# EAGLE design OLM-base_v.REVG (EAGLE 6.4)
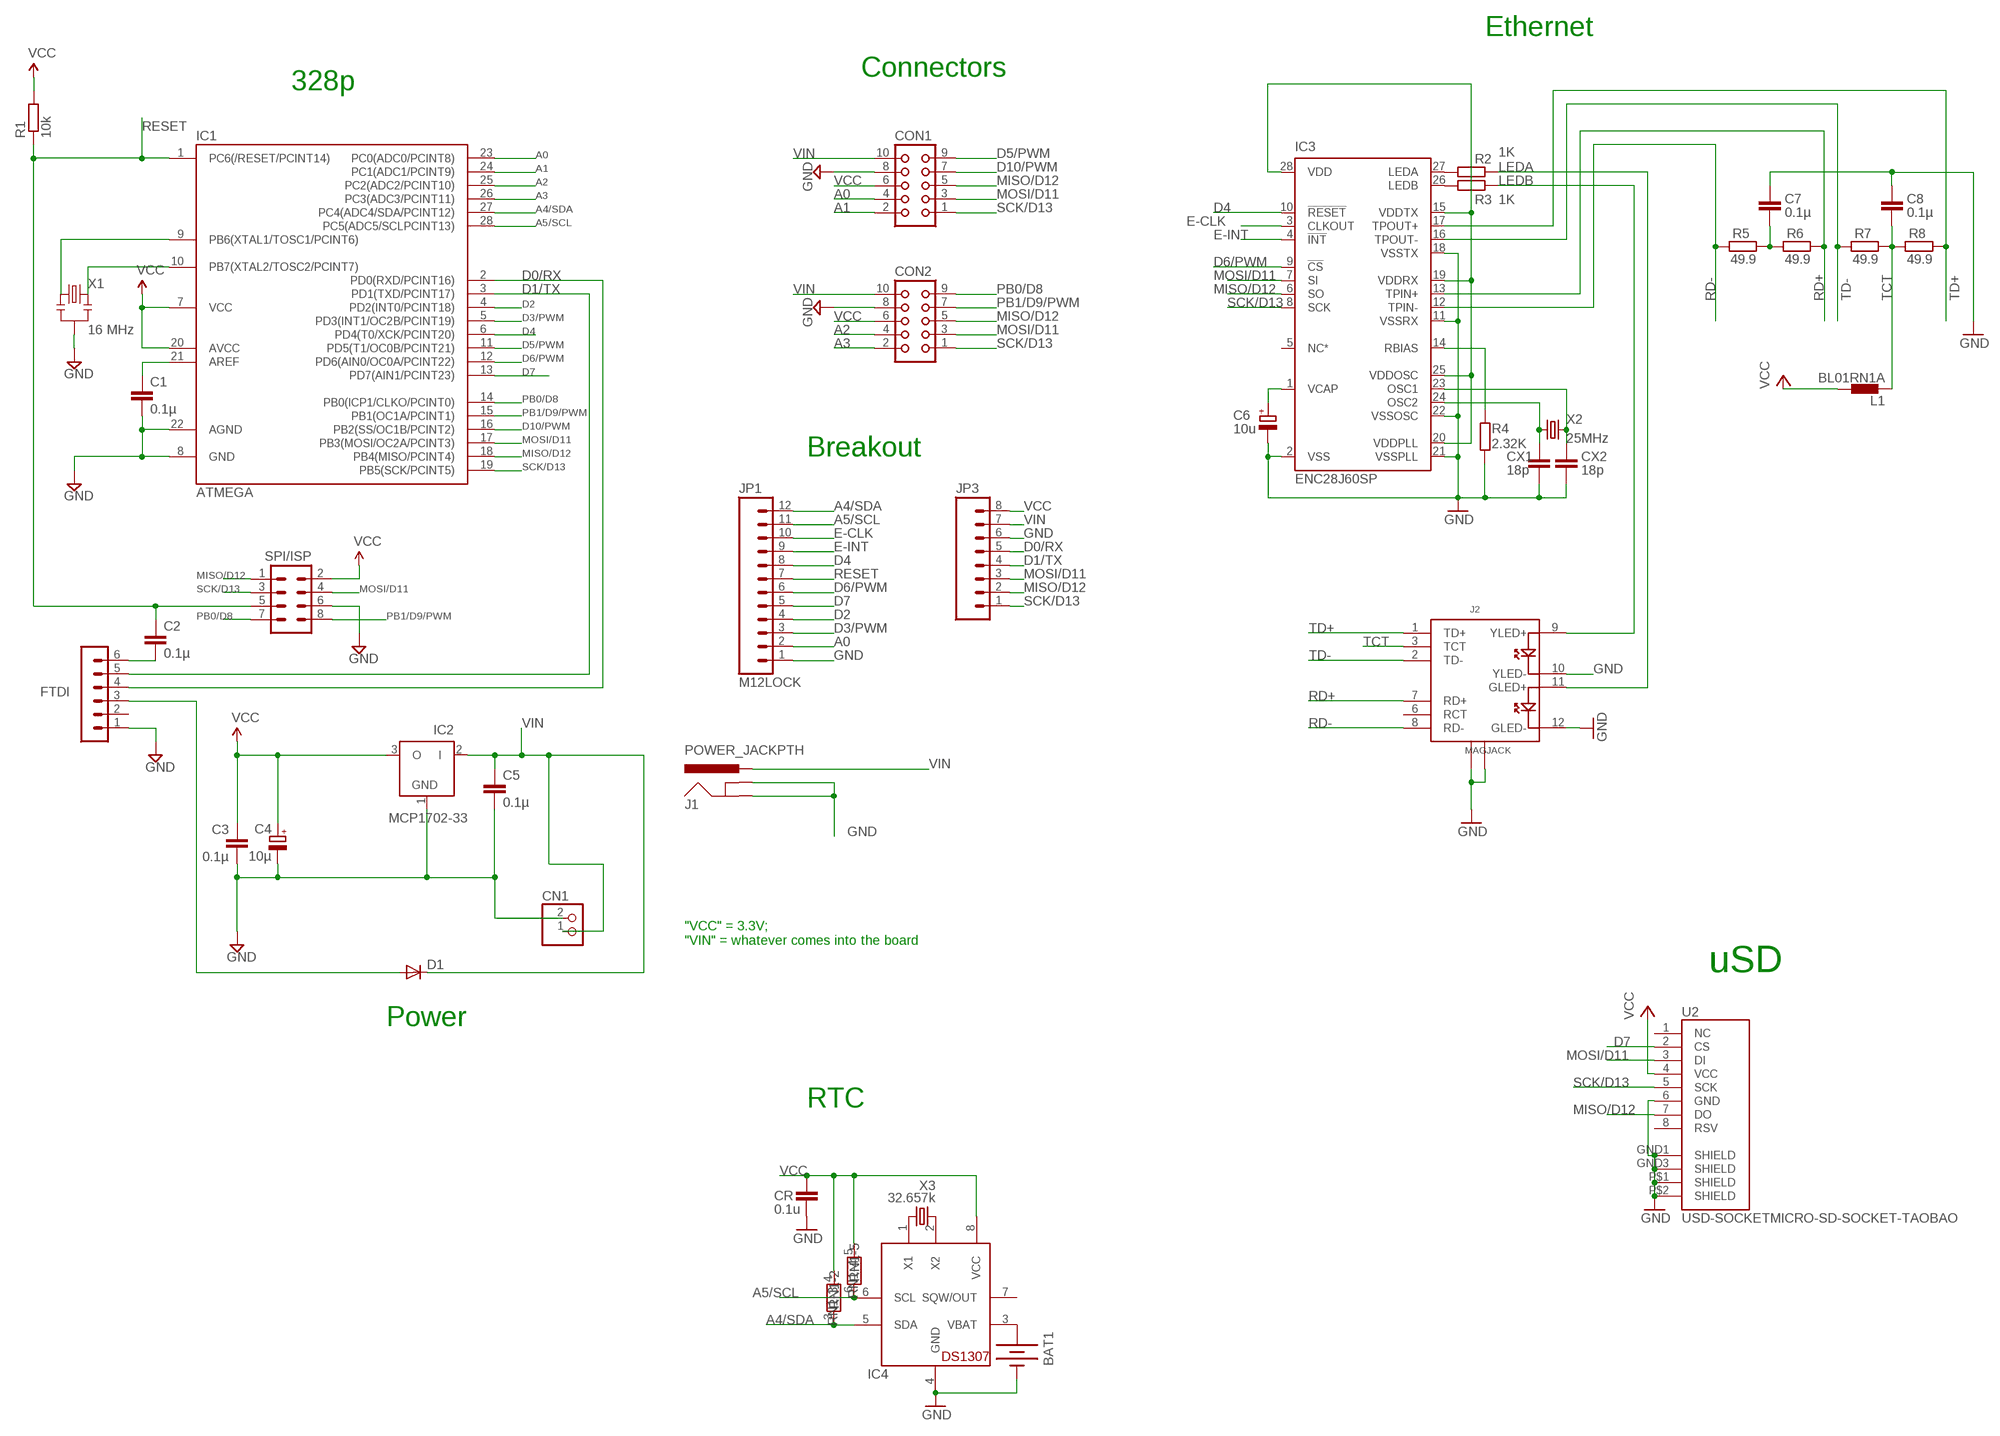
[diagram p0: schematic, sheet 1]

## Parts
BAT1  BATTERY12PTH  [BATTCON_12MM_PTH]
C1  0.1µ  C-EU025-024X044  [C025-024X044]
C2  0.1µ  C-EU025-024X044  [C025-024X044]
C3  0.1µ  C-EU025-024X044  [C025-024X044]
C4  10µ  CPOL-EUE1.8-4  [E1,8-4]
C5  0.1µ  C-EU025-024X044  [C025-024X044]
C6  10u  CPOL-EUE1.8-4  [E1,8-4]
C7  0.1µ  C-EU025-024X044  [C025-024X044]
C8  0.1µ  C-EU025-024X044  [C025-024X044]
CN1  JST_2PIN-THM-RA  [JST-PH-2-THM-RA]
CON1  CON10L  [CON10L]
CON2  CON10L  [CON10L]
CR  0.1u  C-EU025-024X044  [C025-024X044]
CX1  18p  C-EU025-024X044  [C025-024X044]
CX2  18p  C-EU025-024X044  [C025-024X044]
D1  DIODE-D-5  [D-5]
FTDI  FTDI  MA06-1  [MA06-1]
IC1  ATMEGA  ATMEGA48/88/168-PU  [DIL28-3]
IC2  MCP1702-33  MCP1702Z  [TO92]
IC3  ENC28J60SP  [DIL28-3]
IC4  DS1307  [DIL08]
J1  POWER_JACKPTH  [POWER_JACK_PTH]
J2  MAGJACK  [MAGJACK]
JP1  M12LOCK  [1X12_LOCK]
JP3  M08LOCK  [1X08_LOCK]
L1  BL01RN1A  [BL01RN1A]
R1  10k  R-EU_0204/7  [0204/7]
R2  1K  R-EU_0204/7  [0204/7]
R3  1K  R-EU_0204/7  [0204/7]
R4  2.32K  R-EU_0204/7  [0204/7]
R5  49.9  R-EU_0204/7  [0204/7]
R6  49.9  R-EU_0204/7  [0204/7]
R7  49.9  R-EU_0204/7  [0204/7]
R8  49.9  R-EU_0204/7  [0204/7]
RN1  RNX7  [RN-8]
SV1  SPI/ISP  MA04-2  [MA04-2]
U2  USD-SOCKETMICRO-SD-SOCKET-TAOBAO  [MICRO-SD-SOCKET-TAOBAO]
X1  16 MHz  RESONATORPTH  [RESONATOR-PTH]
X2  25MHz  CRYSTALHC49US  [HC49US]
X3  32.657k  CRYSTALTC26H  [TC26H]

## Nets
A0: CON1.4 IC1.23(PC0(ADC0/PCINT8)) JP1.2
A1: CON1.2 IC1.24(PC1(ADC1/PCINT9))
A2: CON2.4 IC1.25(PC2(ADC2/PCINT10))
A3: CON2.2 IC1.26(PC3(ADC3/PCINT11))
A4/SDA: IC1.27(PC4(ADC4/SDA/PCINT12)) IC4.5(SDA) JP1.12 RN1.3
A5/SCL: IC1.28(PC5(ADC5/SCLPCINT13)) IC4.6(SCL) JP1.11 RN1.6
D0/RX: FTDI.4 IC1.2(PD0(RXD/PCINT16)) JP3.5
D1/TX: FTDI.5 IC1.3(PD1(TXD/PCINT17)) JP3.4
D2: IC1.4(PD2(INT0/PCINT18)) JP1.4
D3/PWM: IC1.5(PD3(INT1/OC2B/PCINT19)) JP1.3
D4: IC1.6(PD4(T0/XCK/PCINT20)) IC3.10(!RESET) JP1.8
D5/PWM: CON1.9 IC1.11(PD5(T1/OC0B/PCINT21))
D6/PWM: IC1.12(PD6(AIN0/OC0A/PCINT22)) IC3.9(!CS) JP1.6
D7: IC1.13(PD7(AIN1/PCINT23)) JP1.5 U2.2(CS)
D10/PWM: CON1.7 IC1.16(PB2(SS/OC1B/PCINT2))
E-CLK: IC3.3(CLKOUT) JP1.10
E-INT: IC3.4(!INT) JP1.9
GND [vcc]: BAT1.GND(-) C1.2 C3.2 C4.- C5.2 C6.- C7.1 C8.1 CN1.2 CON1.8 CON2.8 CR.2 CX1.2 CX2.2 FTDI.1 IC1.8(GND) IC1.22(AGND) IC2.1(GND) IC3.2(VSS) IC3.11(VSSRX) IC3.18(VSSTX) IC3.21(VSSPLL) IC3.22(VSSOSC) IC4.4(GND) J1.GND J1.GNDBREAK J2.10(YLED-) J2.12(GLED-) J2.M1(GND1) J2.M2(GND2) JP1.1 JP3.6 R4.2 SV1.6 U2.6(GND) U2.GND1(SHIELD) U2.GND3(SHIELD) U2.P$1(SHIELD) U2.P$2(SHIELD) X1.2
LEDA: J2.11(GLED+) R2.2
LEDB: J2.9(YLED+) R3.2
MISO/D12: CON1.5 CON2.5 IC1.18(PB4(MISO/PCINT4)) IC3.6(SO) JP3.2 SV1.1 U2.7(DO)
MOSI/D11: CON1.3 CON2.3 IC1.17(PB3(MOSI/OC2A/PCINT3)) IC3.7(SI) JP3.3 SV1.4 U2.3(DI)
N$1: IC1.9(PB6(XTAL1/TOSC1/PCINT6)) X1.1
N$2: D1.A FTDI.3
N$19: C1.1 IC1.21(AREF)
N$20: C2.2 FTDI.6
N$21: IC1.10(PB7(XTAL2/TOSC2/PCINT7)) X1.3
N$36: BAT1.VCC@1(+) IC4.3(VBAT)
N$37: IC3.27(LEDA) R2.1
N$39: IC3.26(LEDB) R3.1
N$47: IC4.2(X2) X3.2
N$50: C6.+ IC3.1(VCAP)
N$51: IC3.14(RBIAS) R4.1
N$52: CX1.1 IC3.24(OSC2) X2.1
N$53: CX2.1 IC3.23(OSC1) X2.2
N$54: C7.2 R5.2 R6.1
N$57: IC4.1(X1) X3.1
PB0/D8: CON2.9 IC1.14(PB0(ICP1/CLKO/PCINT0)) SV1.7
PB1/D9/PWM: CON2.7 IC1.15(PB1(OC1A/PCINT1)) SV1.8
RD+: IC3.13(TPIN+) J2.7(RD+) R6.2
RD-: IC3.12(TPIN-) J2.8(RD-) R5.1
RESET: C2.1 IC1.1(PC6(/RESET/PCINT14)) JP1.7 R1.1 SV1.5
SCK/D13: CON1.1 CON2.1 IC1.19(PB5(SCK/PCINT5)) IC3.8(SCK) JP3.1 SV1.3 U2.5(SCK)
TCT: C8.2 J2.3(TCT) L1.1 R7.2 R8.1
TD+: IC3.17(TPOUT+) J2.1(TD+) R8.2
TD-: IC3.16(TPOUT-) J2.2(TD-) R7.1
VCC [vcc]: C3.1 C4.+ CON1.6 CON2.6 CR.1 IC1.7(VCC) IC1.20(AVCC) IC2.3(O) IC3.15(VDDTX) IC3.19(VDDRX) IC3.20(VDDPLL) IC3.25(VDDOSC) IC3.28(VDD) IC4.8(VCC) JP3.8 L1.2 R1.2 RN1.4 RN1.5 SV1.2 U2.4(VCC)
VIN: C5.1 CN1.1 CON1.10 CON2.10 D1.C IC2.2(I) J1.PWR JP3.7
Unconnected: FTDI.2 IC3.5(NC*) IC4.7(SQW/OUT) J2.6(RCT) RN1.1 RN1.2 RN1.7 RN1.8 U2.1(NC) U2.8(RSV)

## Notes on the sheet
- Ethernet
- Connectors
- 328p
- Breakout
- "VCC" = 3.3V;
  "VIN" = whatever comes into the board
- uSD
- Power
- RTC

## Library data of the parts
BAT1 = SparkFun:BATTERY: Battery Holders Various common sizes : AA, AAA, 20mm coin cell and 12mm coin cell.
C1-C3 C5 C7 C8 CX1 CX2 = resistor:C-EU: CAPACITOR, European symbol
C4 C6 = resistor:CPOL-EU: POLARIZED CAPACITOR, European symbol
CN1 = adafruit:JST_2PIN: JST 2-Pin Connectors of various flavors SMT-RA (S2B-PH-SM4) 4UConnector #17311 SMT (B2B-PH-SM4) THM-RA (S2B-PH) THM (B2B-PH)
CON1 CON2 = con-harting:CON10L: CONNECTOR; OC_FARNELL: unknown; OC_NEWARK: unknown
CR = rcl:C-EU: CAPACITOR, European symbol
D1 = diode:DIODE-: DIODE
FTDI = JeeLabs:MA06-1: PIN HEADER
IC1 = atmega8:ATMEGA48/88/168-PU
IC2 = JeeLabs:MCP1702: 200 mA, Low Power Low Dropout Voltage Regulator
IC3 = microchip:ENC28J60: Stand-Alone Ethernet Controller with SPI Interface Source: http://ww1.microchip.com/downloads/en/DeviceDoc/39662c.pdf; MF: MICROCHIP; MPN: ENC28J60/SP; OC_FARNELL: 1084619; OC_NEWARK: 96K3661
IC4 = adafruit:DS1307: DS1307 Real time clock (RTC) with battery backup ability. Talk to it via i2c
J1 = SparkFun-Connectors:POWER_JACK: Power Jack This is the standard 5.5mm barrel jack for power. The PTH is the most common, proven, reliable, footprint. The Slot footprint only works if the mill layer is transmitted to the PCB fab house so be warned. Spark Fun Electronics SKU : PRT-00119 SMT: CONN-08106 Mating wall wart : TOL-00298 (and others)
J2 = SparkFun:MAGJACK
JP1 = SparkFun-Connectors:M12: Header 12 Standard 12-pin 0.1" header. Use with straight break away headers (SKU : PRT-00116), right angle break away headers (PRT-00553), swiss pins (PRT-00743), machine pins (PRT-00117), and female headers (PRT-00115).
JP3 = SparkFun-Connectors:M08: Header 8 Standard 8-pin 0.1" header. Use with straight break away headers (SKU : PRT-00116), right angle break away headers (PRT-00553), swiss pins (PRT-00743), machine pins (PRT-00117), and female headers (PRT-00115).
L1 = inductors:BL0: Noise Suppression Products/EMI Suppression Filters, Lead EMIFIL(R) Inductor Type Source: http://www.murata.com .. BL01RN1_DS.pdf
R1 = resistor:R-EU_: RESISTOR, European symbol
R2-R8 = rcl:R-EU_: RESISTOR, European symbol
RN1 = resistor-net:RNX7: RESISTOR NETWORK; OC_FARNELL: unknown; OC_NEWARK: unknown
SV1 = JeeLabs:MA04-2: PIN HEADER
U2 = SparkFunNew:USD-SOCKET: microSD Socket Push-push type uSD socket. Schematic element and footprint production proven. Spark Fun Electronics SKU : PRT-00127. tDoc lines correctly indicate media card edge positions when inserting (unlocked, locked, depressed).
X1 = SparkFun:RESONATOR: Resonator Small SMD resonator. This is the itty bitty 10/20MHz resonators with built in caps. CSTCE10M0G55 and CSTCE20M0V53. Footprint has been reviewed closely but hasn't been tested yet.
X2 = SparkFun:CRYSTAL: Crystals Various standard crystals. Proven footprints. Spark Fun Electronics SKU : COM-00534
X3 = crystal:CRYSTAL: CRYSTAL; OC_FARNELL: unknown; OC_NEWARK: unknown

## Net classes
0 default: width 0.305 mm, clearance 0.203 mm
1 vcc: width 0.254 mm
2 gnd: width 0.305 mm, drill 0.559 mm, clearance 0.254 mm

## Board
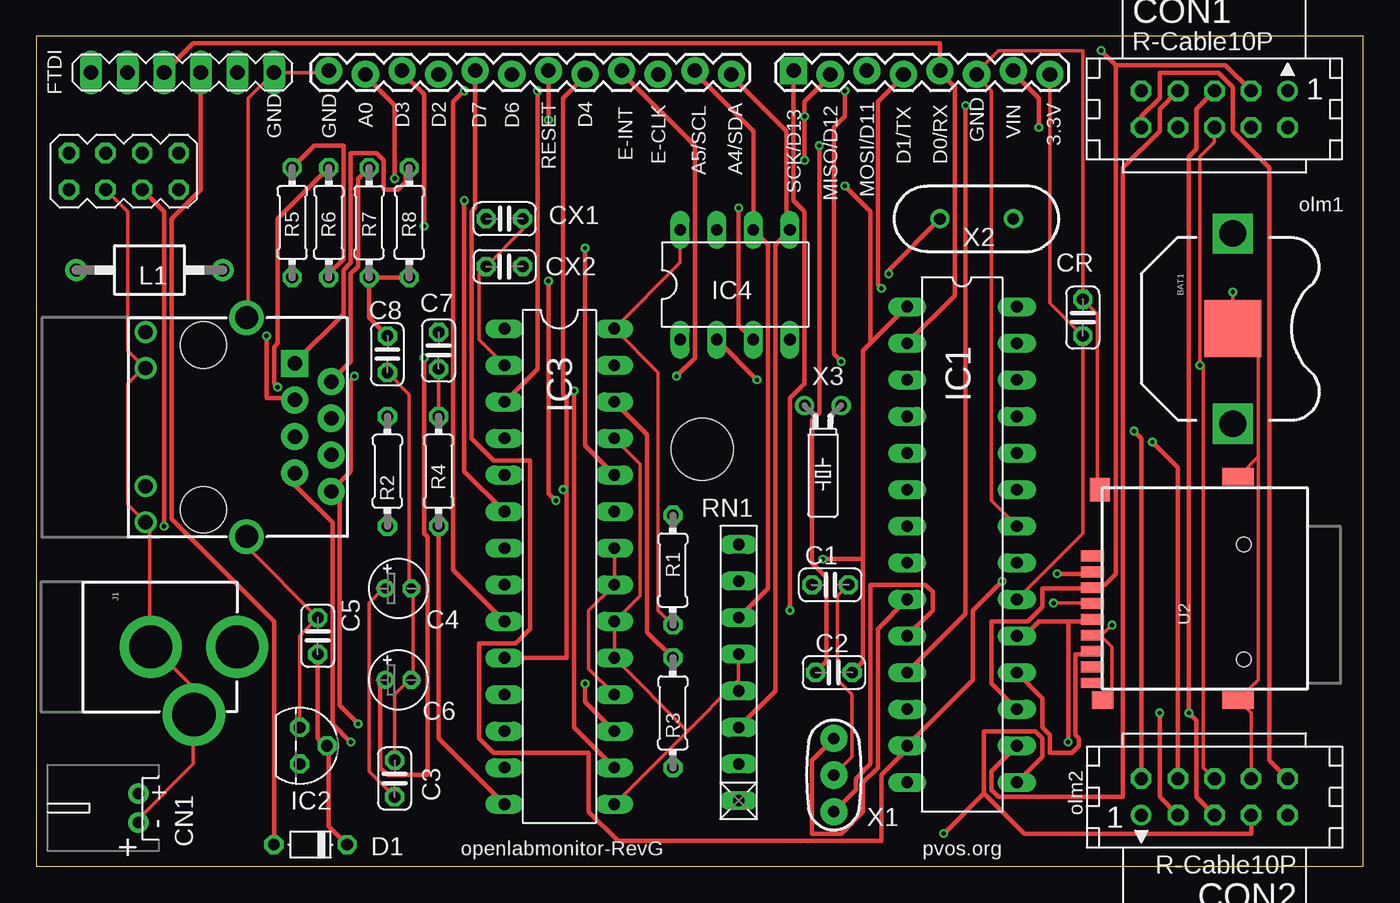
[diagram p1: board, top side]
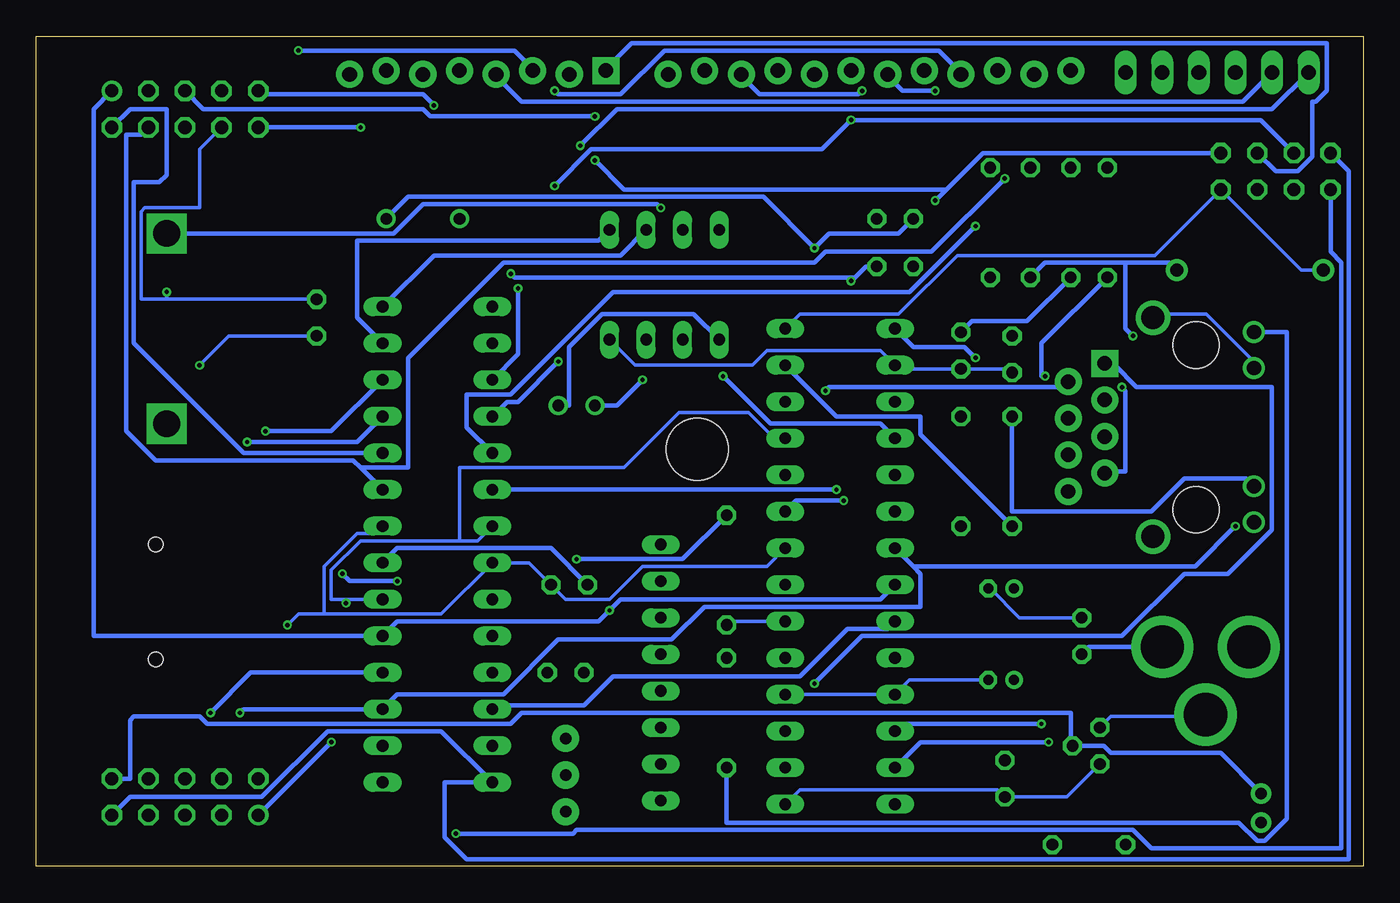
[diagram p2: board, bottom side, seen from below]

Size 92.13 x 57.65 mm. Coordinates in mm from the lower left corner, seen from the top.
Outline: 0,0 92.13,0 92.13,57.65 0,57.65 0,0
Copper layers (1*16): Top 0.035mm / dielectric 1.5mm / Bottom 0.035mm
Design rules "Fusion_eagle_rule_v1.1": minimum track width 6mil, minimum drill 12mil, track to track 6mil, track to pad 6mil, pad to pad 6mil, via to via 6mil, smd to smd 0mil, copper to edge 10mil, drill to drill 10mil, minimum pad ring 10mil, minimum via ring 6mil, stop-mask expansion 2mil, vias tented up to drill 100mil, thermal gap 10mil
Holes 4.32 mm at 46.23,28.96

### Footprints (pad centres in the part's own frame; a part is rotated, then mirrored left to right if it is on the bottom)
BATTCON_12MM_PTH = smd 3.962 x 3.962: GND 0,0 | drill 1.854 square: VCC@1 -6.604,0; VCC@2 6.604,0
C025-024X044 = drill 0.813 octagon: 1 -1.27,0; 2 1.27,0
E1,8-4 = drill 0.711 pad 1.168: + -0.889,0 | drill 0.711 pad 1.168 octagon: - 0.889,0
JST-PH-2-THM-RA = drill 0.8 pad 1.422: 1 1,0; 2 -1,0
CON10L = drill 0.914: 1 5.08,1.27 | drill 0.914 octagon: 2 5.08,-1.27; 3 2.54,1.27; 4 2.54,-1.27; 5 0,1.27; 6 0,-1.27; 7 -2.54,1.27; 8 -2.54,-1.27; 9 -5.08,1.27; 10 -5.08,-1.27
D-5 = drill 0.813 octagon: A 2.54,0; C -2.54,0
MA06-1 = drill 1.016 long: 1 0,0; 2 2.54,0; 3 5.08,0; 4 7.62,0; 5 10.16,0; 6 12.7,0
DIL28-3 = drill 0.813 long: 1 -16.51,-3.81; 2 -13.97,-3.81; 3 -11.43,-3.81; 4 -8.89,-3.81; 5 -6.35,-3.81; 6 -3.81,-3.81; 7 -1.27,-3.81; 8 1.27,-3.81; 9 3.81,-3.81; 10 6.35,-3.81; 11 8.89,-3.81; 12 11.43,-3.81; 13 13.97,-3.81; 14 16.51,-3.81; 15 16.51,3.81; 16 13.97,3.81; 17 11.43,3.81; 18 8.89,3.81; 19 6.35,3.81; 20 3.81,3.81; 21 1.27,3.81; 22 -1.27,3.81; 23 -3.81,3.81; 24 -6.35,3.81; 25 -8.89,3.81; 26 -11.43,3.81; 27 -13.97,3.81; 28 -16.51,3.81
TO92 = drill 0.813 octagon: 1 -1.27,0; 2 0,1.905; 3 1.27,0
DIL08 = drill 0.813 long: 1 -3.81,-3.81; 2 -1.27,-3.81; 3 1.27,-3.81; 4 3.81,-3.81; 5 3.81,3.81; 6 1.27,3.81; 7 -1.27,3.81; 8 -3.81,3.81
POWER_JACK_PTH = drill 2.997 pad 4.318: GND 0,7.7; GNDBREAK 4.7,10.7; PWR 0,13.7
MAGJACK = drill 1 pad 1.88 square: 1 3.175,17.445 | drill 1 pad 1.88: 2 4.445,19.985; 3 5.715,17.445; 4 6.985,19.985; 5 8.255,17.445; 6 9.525,19.985; 7 10.795,17.445; 8 12.065,19.985 | drill 1 pad 1.27: 9 1,7.1; 10 3.5,7.1; 11 11.7,7.1; 12 14.2,7.1 | drill 1.6 pad 2.184: M1 0,14.1; M2 15.2,14.1 | hole 3.2: 1.905,11.095; 13.335,11.095
1X12_LOCK = drill 1.016 pad 1.88: 1 0,0.127; 2 2.54,-0.127; 3 5.08,0.127; 4 7.62,-0.127; 5 10.16,0.127; 6 12.7,-0.127; 7 15.24,0.127; 8 17.78,-0.127; 9 20.32,0.127; 10 22.86,-0.127; 11 25.4,0.127; 12 27.94,-0.127
1X08_LOCK = drill 1.016 pad 1.88 square: 1 0,0.127 | drill 1.016 pad 1.88: 2 2.54,-0.127; 3 5.08,0.127; 4 7.62,-0.127; 5 10.16,0.127; 6 12.7,-0.127; 7 15.24,0.127; 8 17.78,-0.127
BL01RN1A = drill 0.9 pad 1.5: 1 -5.08,0; 2 5.08,0
0204/7 = drill 0.813 octagon: 1 -3.81,0; 2 3.81,0
RN-8 = drill 0.813 long: 1 -8.89,0; 2 -6.35,0; 3 -3.81,0; 4 -1.27,0; 5 1.27,0; 6 3.81,0; 7 6.35,0; 8 8.89,0
MA04-2 = drill 0.9 octagon: 1 -3.81,-1.27; 2 -3.81,1.27; 3 -1.27,-1.27; 4 -1.27,1.27; 5 1.27,-1.27; 6 1.27,1.27; 7 3.81,-1.27; 8 3.81,1.27
MICRO-SD-SOCKET-TAOBAO = smd 0.75 x 1.6: 1 2.25,10.5; 2 1.15,10.5; 3 0.05,10.5; 4 -1.05,10.5; 5 -2.15,10.5; 6 -3.25,10.5; 7 -4.35,10.5; 8 -5.45,10.5 | smd 0.7 x 1.6: CD -6.55,10.5 | smd 1.2 x 1.5: GND1 -7.75,9.8 | smd 1.6 x 1.4: GND3 6.85,10 | smd 1.2 x 2.2: P$1 7.75,0.4; P$2 -7.75,0.4 | hole 1: 3.05,0; -4.93,0
RESONATOR-PTH = drill 0.8 pad 1.88: 1 -2.54,0; 2 0,0; 3 2.54,0
HC49US = drill 0.813: 1 -2.54,0; 2 2.54,0
TC26H = drill 0.813: 1 -1.27,0; 2 1.27,0

### Placement (x,y rotation side)
BAT1  83.06,37.34 270 top
C1  55.12,19.56 0 top
C2  55.37,13.46 180 top
C3  24.89,6.1 90 top
C4  25.15,19.3 0 top
C5  19.56,16 90 top
C6  25.15,12.95 0 top
C7  27.94,35.81 90 top
C8  24.38,35.56 90 top
CN1  7.11,4.06 90 top
CON1  81.79,52.58 0 top
CON2  81.79,4.83 180 top
CR  72.64,38.1 90 top
CX1  32.51,44.96 0 top
CX2  32.51,41.66 180 top
D1  19.05,1.52 180 top
FTDI  16.51,55.12 180 top
IC1  64.26,22.35 270 top
IC2  18.29,8.38 270 top
IC3  36.32,20.83 270 top
IC4  48.51,40.39 0 top
J1  0.25,15.24 270 top
J2  0.51,38.1 270 top
JP1  20.32,55.12 0 top
JP3  52.58,55.12 0 top
L1  7.87,41.4 180 top
R1  44.2,20.57 270 top
R2  24.38,27.43 90 top
R3  44.2,10.67 270 top
R4  27.94,27.43 90 top
R5  17.78,44.7 90 top
R6  20.32,44.7 90 top
R7  23.11,44.7 270 top
R8  25.91,44.7 90 top
RN1  48.77,13.46 90 top
SV1  6.1,48.26 180 top
U2  83.82,19.3 90 top
X1  55.37,6.35 270 top
X2  65.28,44.96 180 top
X3  54.61,32 180 top

### Tracks (layer width: path | path; a pad name or v marks a point on that pad's centre or on a via)
A0  (via drill 0.3)
  Top 0.305: v24.89,47.75 24.89,52.83 22.86,54.86 JP1.2
  Bottom 0.305: 69.6,27.69 70.1,28.19 83.82,28.19 85.85,30.23 85.85,50.8 84.84,50.8 CON1.4 | 69.6,27.69 IC1.23 | v24.89,47.75 29.97,42.67 37.34,42.67 38.1,41.91 59.69,41.91 66.29,35.31 66.29,27.69 69.6,27.69
A1
  Bottom 0.305: IC1.24 77.72,28.7 85.34,36.32 85.34,47.5 83.57,47.5 83.06,48.01 83.06,52.58 85.6,52.58 CON1.2
A2  (via drill 0.3)
  Top 0.305: v77.47,29.46 79.25,27.69 CON2.4
  Bottom 0.305: IC1.25 69.85,29.46 v77.47,29.46
A3  (via drill 0.3)
  Top 0.305: v76.2,30.23 76.71,29.72 CON2.2
  Bottom 0.305: IC1.26 71.63,30.23 v76.2,30.23
A4/SDA
  Top 0.305: RN1.3 51.31,12.19 51.31,43.18 52.07,43.94 | 52.07,43.94 52.07,51.05 48.26,54.86 JP1.12 | 52.07,43.94 IC4.5
  Bottom 0.305: IC1.27 69.85,38.1 69.85,43.43 53.09,43.43 IC4.5
A5/SCL
  Top 0.305: RN1.6 50.8,19.3 50.8,43.18 IC4.6 49.78,51.05 45.72,55.12 JP1.11
  Bottom 0.305: IC1.28 64.52,42.42 51.56,42.42 IC4.6
D0/RX
  Top 0.305: IC1.2 63.75,39.62 63.75,54.1 62.74,55.12 JP3.5 62.74,57.15 10.92,57.15 FTDI.4
D1/TX  (via drill 0.3)
  Top 0.305: v58.67,40.13 58.42,40.39 58.42,53.09 60.2,54.86 JP3.4
  Bottom 0.305: IC1.3 58.67,35.56 v58.67,40.13 | FTDI.5 8.38,53.09 58.42,53.09 60.2,54.86 JP3.4
D2  (via drill 0.3)
  Top 0.305: v55.88,35.05 55.37,35.56 55.37,51.31 56.13,52.07 v56.13,53.85
  Bottom 0.305: IC1.4 59.44,32.26 58.67,32.26 v55.88,35.05 | v56.13,53.85 55.88,53.59 51.56,53.59 48.51,56.64 29.46,56.64 27.94,55.12 JP1.4
D3/PWM  (via drill 0.3)
  Top 0.305: v26.92,44.45 26.92,53.59 25.4,55.12 JP1.3
  Bottom 0.305: IC1.5 62.23,30.48 62.23,32.77 59.18,32.77 52.07,39.88 31.5,39.88 v26.92,44.45
D4  (via drill 0.3)
  Top 0.305: IC3.10 36.83,14.48 36.83,26.16 | 36.83,26.16 36.83,32.51 36.58,32.77 36.58,53.34 38.1,54.86 JP1.8 | 36.83,26.16 v36.58,26.16
  Bottom 0.305: v36.58,26.16 IC1.6
D5/PWM  (via drill 0.3)
  Top 0.305: IC1.11 64.52,17.53 v64.52,52.83
  Bottom 0.305: v64.52,52.83 65.28,53.59 76.45,53.59 CON1.9
D6/PWM  (via drill 0.3)
  Top 0.305: v29.72,53.85 28.96,53.09 28.96,20.57 IC3.9
  Bottom 0.305: IC3.9 33.02,16.51 35.81,16.51 39.12,13.21 52.07,13.21 54.1,11.18 60.2,11.18 IC1.12 | v29.72,53.85 32,53.85 33.02,54.86 JP1.6
D7  (via drill 0.3)
  Top 0.305: v70.87,20.32 73.15,20.32 U2.2 | v67.06,19.81 65.02,17.78 65.02,12.95 IC1.13 60.45,8.13 58.67,6.35 58.67,1.78 40.39,1.78 38.35,3.81 38.35,7.87 31.75,7.87 30.73,8.89 30.73,15.49 33.27,15.49 34.29,16.51 34.29,28.19 31.75,28.19 30.23,29.72 30.23,45.47 30.48,45.72 JP1.5
  Bottom 0.305: v70.87,20.32 70.36,19.81 v67.06,19.81
D10/PWM
  Top 0.305: IC1.16 66.29,6.6 66.29,5.33 66.8,4.83 75.44,4.83 75.44,48.51 77.98,51.05 77.98,52.58 CON1.7
E-CLK  (via drill 0.3)
  Top 0.305: IC3.3 34.8,34.54 v34.8,53.85
  Bottom 0.305: v34.8,53.85 35.05,53.59 41.91,53.59 43.18,54.86 JP1.10
E-INT  (via drill 0.3)
  Top 0.305: v44.45,34.04 45.72,35.31 45.72,50.04 40.64,55.12 JP1.9
  Bottom 0.305: IC3.4 33.53,30.73 41.15,30.73 v44.45,34.04
GND  (via drill 0.3)
  Top 0.254: CON2.8 84.33,10.67 83.57,11.43 U2.P$2 83.57,11.68 84.84,12.95 84.84,28.45 | 84.84,28.45 83.57,27.18 U2.P$1 | 84.84,28.45 84.84,35.56 BAT1.GND v83.06,39.88 | U2.GND3 73.66,26.16 73.66,38.35 CR.2 72.64,56.64 66.8,56.64 65.28,55.12 JP3.6 65.28,54.86 66.29,53.85 66.29,25.4 IC1.22 | CX1.2 33.78,44.2 CX2.2 30.73,41.15 30.73,36.58 IC3.2 | C7.1 R4.2 | JP1.1 20.32,55.12 FTDI.1 14.73,53.34 14.73,38.1 J2.M1 | SV1.6 6.35,45.47 6.35,35.81 7.37,34.8 J2.10 7.37,34.54 6.35,33.53 6.35,25.15 7.37,24.13 J2.12 7.62,23.88 7.87,23.62 7.87,15.24 J1.GND 8.13,15.24 10.92,12.45 10.92,10.67 J1.GNDBREAK 10.92,10.41 10.92,7.11 7.11,3.3 CN1.2 | 73.91,16 74.68,15.24 74.68,12.19 74.17,11.68 U2.GND1 | 73.91,16 73.41,16 U2.6 73.91,16 | v74.68,16.76 73.91,16 | X1.2 56.64,7.62 56.64,11.94 55.63,12.95 55.63,18.8 C1.2 | IC3.22 IC3.21 38.35,17.78 38.35,13.72 IC3.18 | C3.2 24.89,11.94 25.91,12.95 C6.- 26.16,12.95 26.16,19.3 C4.- 25.91,19.3 25.91,32.77 C8.1 | J2.M2 14.73,22.86 14.73,22.1 C5.2 18.29,16 IC2.1
  Bottom 0.254: CON1.8 80.77,49.78 80.77,45.72 84.58,45.72 84.84,45.47 84.84,39.37 83.06,39.37 | CR.2 83.06,39.37 | 83.06,39.37 v83.06,39.88 | C8.1 24.64,34.54 C7.1 32.26,34.54 IC3.2 33.53,35.81 41.4,35.81 42.42,34.8 50.55,34.8 IC4.4 | J2.M1 14.48,38.1 14.22,38.35 10.92,38.35 7.37,34.8 J2.10 | IC1.22 68.58,23.11 69.85,23.11 72.14,20.83 72.14,17.53 | 72.14,17.53 64.01,17.53 IC1.8 57.91,21.08 C1.2 55.37,18.54 52.32,18.54 50.04,20.83 41.4,20.83 IC3.22 | v74.68,16.76 73.91,17.53 72.14,17.53 | C6.- 31.5,12.95 IC3.11 IC3.18 | IC2.1 17.53,10.41 11.18,10.41 J1.GNDBREAK | C5.2 23.88,17.27 25.91,19.3 C4.-
LEDA
  Bottom 0.305: R2.2 24.38,24.64 14.73,24.64 12.45,26.92 8.13,26.92 7.62,26.42 J2.11
LEDB
  Bottom 0.305: R3.2 44.2,3.05 8.64,3.05 7.37,1.78 6.86,1.78 5.33,3.3 5.33,37.08 7.37,37.08 J2.9
MISO/D12  (via drill 0.3)
  Top 0.305: IC1.18 69.85,11.68 69.85,9.65 70.36,9.14 70.36,7.87 71.88,7.87 72.39,8.38 72.39,8.89 72.14,9.14 72.14,14.73 73.15,14.73 U2.7 | CON2.5 80.52,4.83 80.52,10.16 v80.01,10.67 80.01,49.28 80.52,49.78 80.52,52.58 CON1.5 | IC3.6 29.72,27.43 v29.72,46.23 | v53.34,49.02 v53.34,52.07 53.34,53.09 55.12,54.86 JP3.2
  Bottom 0.305: v80.01,10.67 77.22,13.46 IC1.18 | 28.96,46.99 26.42,49.53 SV1.1 | 28.96,46.99 v29.72,46.23 | v53.34,49.02 51.31,46.99 28.96,46.99 | CON1.5 80.52,52.58 65.28,52.58 64.77,52.07 v53.34,52.07
MOSI/D11  (via drill 0.3)
  Top 0.305: IC1.17 66.29,12.7 66.29,17.02 68.83,17.02 69.85,18.03 69.85,19.3 73.15,19.3 U2.3 73.41,19.56 74.17,19.56 74.93,20.32 74.93,55.63 | SV1.4 8.89,45.47 v8.89,23.62 | CON2.3 77.98,4.83 v77.98,10.67 | CON1.3 82.55,55.63 74.93,55.63 | 74.93,55.63 v73.91,56.64
  Bottom 0.305: 31.24,20.83 30.73,20.32 30.73,18.03 45.72,18.03 48.01,15.75 55.88,15.75 59.69,11.94 67.06,11.94 IC1.17 77.72,10.92 v77.98,10.67 | 31.24,20.83 IC3.7 | v8.89,23.62 11.68,20.83 31.24,20.83 | v73.91,56.64 58.93,56.64 57.66,55.37 JP3.3
N$1
  Top 0.305: IC1.9 58.42,16.51 58.42,6.86 57.4,5.84 57.4,3.81 55.88,2.29 53.85,2.29 53.85,7.37 X1.1
N$2
  Top 0.305: D1.A 16.51,17.02 9.4,24.13 9.4,44.96 11.43,46.99 FTDI.3
N$19
  Bottom 0.305: C1.1 56.39,22.1 67.06,22.1 IC1.21
N$20  (via drill 0.3)
  Top 0.305: C2.2 54.86,14.22 54.86,20.07 53.85,21.08 53.85,30.99 54.36,31.5 v54.36,50.04
  Bottom 0.305: v54.36,50.04 51.82,52.58 6.35,52.58 FTDI.6
N$21
  Top 0.305: IC1.10 62.23,17.78 62.23,19.05 61.72,19.56 57.91,19.56 57.91,7.11 56.9,6.1 56.9,5.33 X1.3
N$36  (via drill 0.3)
  Top 0.305: IC4.3 48.77,37.59 v48.77,45.72
  Bottom 0.305: v48.77,45.72 49.02,45.97 65.28,45.97 67.31,43.94 BAT1.VCC@1
N$37
  Bottom 0.305: R2.1 30.73,29.97 30.73,31.24 36.58,31.24 IC3.27
N$39
  Top 0.305: R3.1 42.42,16.26 42.42,29.97 IC3.26
N$47  (via drill 0.3)
  Top 0.305: v50.04,33.78 IC4.2
  Bottom 0.305: v50.04,33.78 51.82,32 X3.2
N$50  (via drill 0.3)
  Top 0.305: v26.92,35.31 26.92,23.11 27.18,22.86 27.18,6.35 24.38,6.35 23.88,6.86 23.88,12.7 24.13,12.95 C6.+
  Bottom 0.305: v26.92,35.31 27.69,36.07 31.24,36.07 IC3.1
N$51
  Top 0.305: IC3.14 27.94,8.89 R4.1
N$52  (via drill 0.3)
  Top 0.305: IC3.24 38.1,29.21 v38.1,42.93
  Bottom 0.305: CX1.1 32.26,43.94 37.08,43.94 v38.1,42.93 41.66,46.48 66.29,46.48 X2.1
N$53  (via drill 0.3)
  Top 0.305: v36.07,25.4 35.56,25.91 v35.56,40.64 | X2.2 59.18,41.4 v59.18,41.15
  Bottom 0.305: IC3.23 39.37,25.4 v36.07,25.4 | 35.31,40.89 34.54,41.66 CX2.1 | 35.31,40.89 v35.56,40.64 | v59.18,41.15 58.93,40.89 35.31,40.89
N$54
  Top 0.305: R5.2 19.3,50.04 21.34,50.04 21.34,42.16 20.32,41.15 R6.1
  Bottom 0.305: R6.1 23.37,37.85 27.18,37.85 C7.2
N$57
  Bottom 0.305: IC4.1 46.48,38.35 52.83,38.35 55.12,36.07 55.12,32 X3.1
PB0/D8
  Bottom 0.305: CON2.9 85.6,4.83 76.45,4.83 71.88,9.4 64.01,9.4 IC1.14 63.75,5.84 63.75,2.03 62.23,0.51 1.02,0.51 1.02,48.26 SV1.7
PB1/D9/PWM  (via drill 0.3)
  Top 0.305: IC1.15 69.85,7.62 69.85,8.89 69.34,9.4 65.79,9.4 65.79,5.08 | 65.79,5.08 68.58,2.29 84.33,2.29 CON2.7 | 65.79,5.08 v62.99,2.29
  Bottom 0.305: SV1.8 2.29,42.67 1.52,41.91 1.52,1.27 14.73,1.27 16,2.54 54.61,2.54 54.86,2.29 v62.99,2.29
RD+  (via drill 0.3)
  Top 0.305: v21.84,8.64 20.57,9.91 20.57,23.88 18.03,26.42 18.03,27.18 J2.7 | R6.2 16.76,44.96 16.76,36.32 16.51,36.07 16.51,33.53 v16.76,33.27
  Bottom 0.305: IC3.13 30.73,8.64 v21.84,8.64 | v16.76,33.27 16.51,33.02 16.51,27.43 17.78,27.43 J2.7
RD-  (via drill 0.3)
  Top 0.305: v22.35,9.91 21.08,11.18 21.08,25.4 20.57,25.91 J2.8 20.57,26.16 21.84,27.43 21.84,33.78 v22.1,34.04
  Bottom 0.305: IC3.12 32,9.91 v22.35,9.91 | R5.1 22.35,36.32 22.35,34.04 v22.1,34.04
RESET  (via drill 0.3)
  Top 0.305: JP1.7 v35.56,51.82 | 57.4,21.34 v54.61,21.34 | 57.4,21.34 57.4,14.22 C2.1 | 57.91,36.32 57.4,35.81 57.4,21.34 | 57.91,36.32 IC1.1 | v56.13,47.24 57.91,45.47 57.91,36.32
  Bottom 0.305: SV1.5 7.11,51.82 v35.56,51.82 37.59,49.78 53.59,49.78 v56.13,47.24 | R1.1 47.24,21.34 v54.61,21.34
SCK/D13  (via drill 0.3)
  Top 0.305: 71.63,17.02 69.6,17.02 68.58,16 IC1.19 | 71.63,17.02 73.15,17.02 U2.5 | 71.63,17.02 v71.63,8.64 | JP3.1 52.58,46.23 53.34,45.47 53.34,33.53 52.32,32.51 v52.32,17.78
  Bottom 0.305: SV1.3 6.1,48.26 4.57,48.26 3.56,49.28 3.56,53.09 3.3,53.09 2.54,53.85 2.54,57.15 50.8,57.15 52.58,55.37 JP3.1 | IC3.8 33.53,18.54 51.56,18.54 v52.32,17.78 53.09,17.02 67.06,17.02 IC1.19 88.14,16 88.14,52.58 CON1.1 | v71.63,8.64 CON2.1
TCT  (via drill 0.3)
  Top 0.305: C8.2 23.11,38.1 R7.2 R8.1 | v16,36.83 16,32.51 17.78,32.51 J2.3
  Bottom 0.305: L1.1 13.46,41.91 16.51,41.91 | 16.51,41.91 22.1,41.91 R7.2 | v16,36.83 16.51,37.34 16.51,41.91
TD+  (via drill 0.3)
  Top 0.305: IC3.17 38.1,11.43 v38.1,12.7 | R8.2 25.65,48.26 25.65,47.5 25.15,46.99 24.13,46.99 24.13,49.02 23.62,49.53 21.84,49.53 21.84,41.91 21.34,41.4 21.34,38.35 18.03,35.05 J2.1
  Bottom 0.305: v38.1,12.7 34.8,16 16.76,16 12.45,20.32 9.4,20.32 6.35,23.37 6.35,33.27 15.75,33.27 17.27,34.8 17.78,34.8 J2.1
TD-  (via drill 0.3)
  Top 0.305: IC3.16 37.34,9.65 v37.34,33.02 | R7.1 22.35,47.75 22.35,41.66 21.84,41.15 21.84,35.05 20.57,33.78 J2.2
  Bottom 0.305: v37.34,33.02 37.08,33.27 20.83,33.27 20.57,33.53 J2.2
VCC  (via drill 0.3)
  Top 0.254: CON2.6 81.03,6.86 81.03,34.8 | 81.03,34.8 80.77,35.05 80.77,49.28 81.79,50.29 CON1.6 | v70.61,18.29 73.15,18.29 U2.4 | JP3.8 70.36,39.12 CR.1 72.64,23.11 IC1.20 | v80.77,34.8 81.03,34.8 | C3.1 23.11,6.6 23.11,18.29 24.13,19.3 C4.+ | 48.51,12.7 48.77,12.95 RN1.5 | 48.51,12.7 45.21,9.4 | 45.21,9.4 IC3.15 | RN1.4 48.51,12.45 48.51,12.7 | IC4.8 44.7,41.91 IC3.28 43.18,34.29 43.18,17.78 R1.2 | IC3.25 41.91,27.94 41.91,18.8 IC3.20 IC3.19 45.21,9.4
  Bottom 0.254: 70.36,18.54 v70.61,18.29 | IC1.20 70.36,18.54 | IC1.7 61.47,22.61 62.74,22.61 | 62.74,22.61 69.6,22.61 71.63,20.57 71.63,18.54 70.36,18.54 | v80.77,34.8 78.74,36.83 CR.1 | IC2.3 20.57,4.83 C3.1 25.4,5.33 39.12,5.33 IC3.15 | L1.2 4.32,41.4 SV1.2 14.48,42.42 28.19,42.42 32.26,38.35 39.12,38.35 IC3.28 | R1.2 43.94,17.02 IC3.20 | 62.74,22.61 62.74,27.69 51.31,27.69 47.5,31.5 42.67,31.5 40.89,29.72 IC3.25
VIN  (via drill 0.3)
  Top 0.305: C5.1 19.56,8.89 20.07,8.38 IC2.2 20.32,8.38 20.32,2.79 D1.C | CON2.10 85.6,7.37 85.6,48.51 83.06,51.05 83.06,54.1 82.04,55.12 77.98,55.12 77.98,53.34 76.71,52.07 CON1.10 | v69.6,51.31 69.6,53.34 67.82,55.12 JP3.7
  Bottom 0.305: C5.1 19.05,15.24 J1.PWR | CN1.1 7.11,5.08 9.91,7.87 17.53,7.87 18.03,8.38 IC2.2 20.32,8.38 20.32,10.67 58.42,10.67 59.18,9.91 80.26,9.91 80.77,10.41 85.34,10.41 85.6,10.16 85.6,6.1 CON2.10 | CON1.10 v69.6,51.31

### Text on the board
tPlace: FTDI | D7 | D6 | RESET | GND | GND | A0 | D3 | D2 | D4 | VIN | GND | 3.3V | E-INT | E-CLK | D1/TX | D0/RX | A5/SCL | A4/SDA | SCK/D13 | MISO/D12 | MOSI/D11 | olm1 | olm2 | X1 | pvos.org | + | openlabmonitor-RevG